# EAGLE design iomodul_shield_basic (EAGLE 6.6.0)
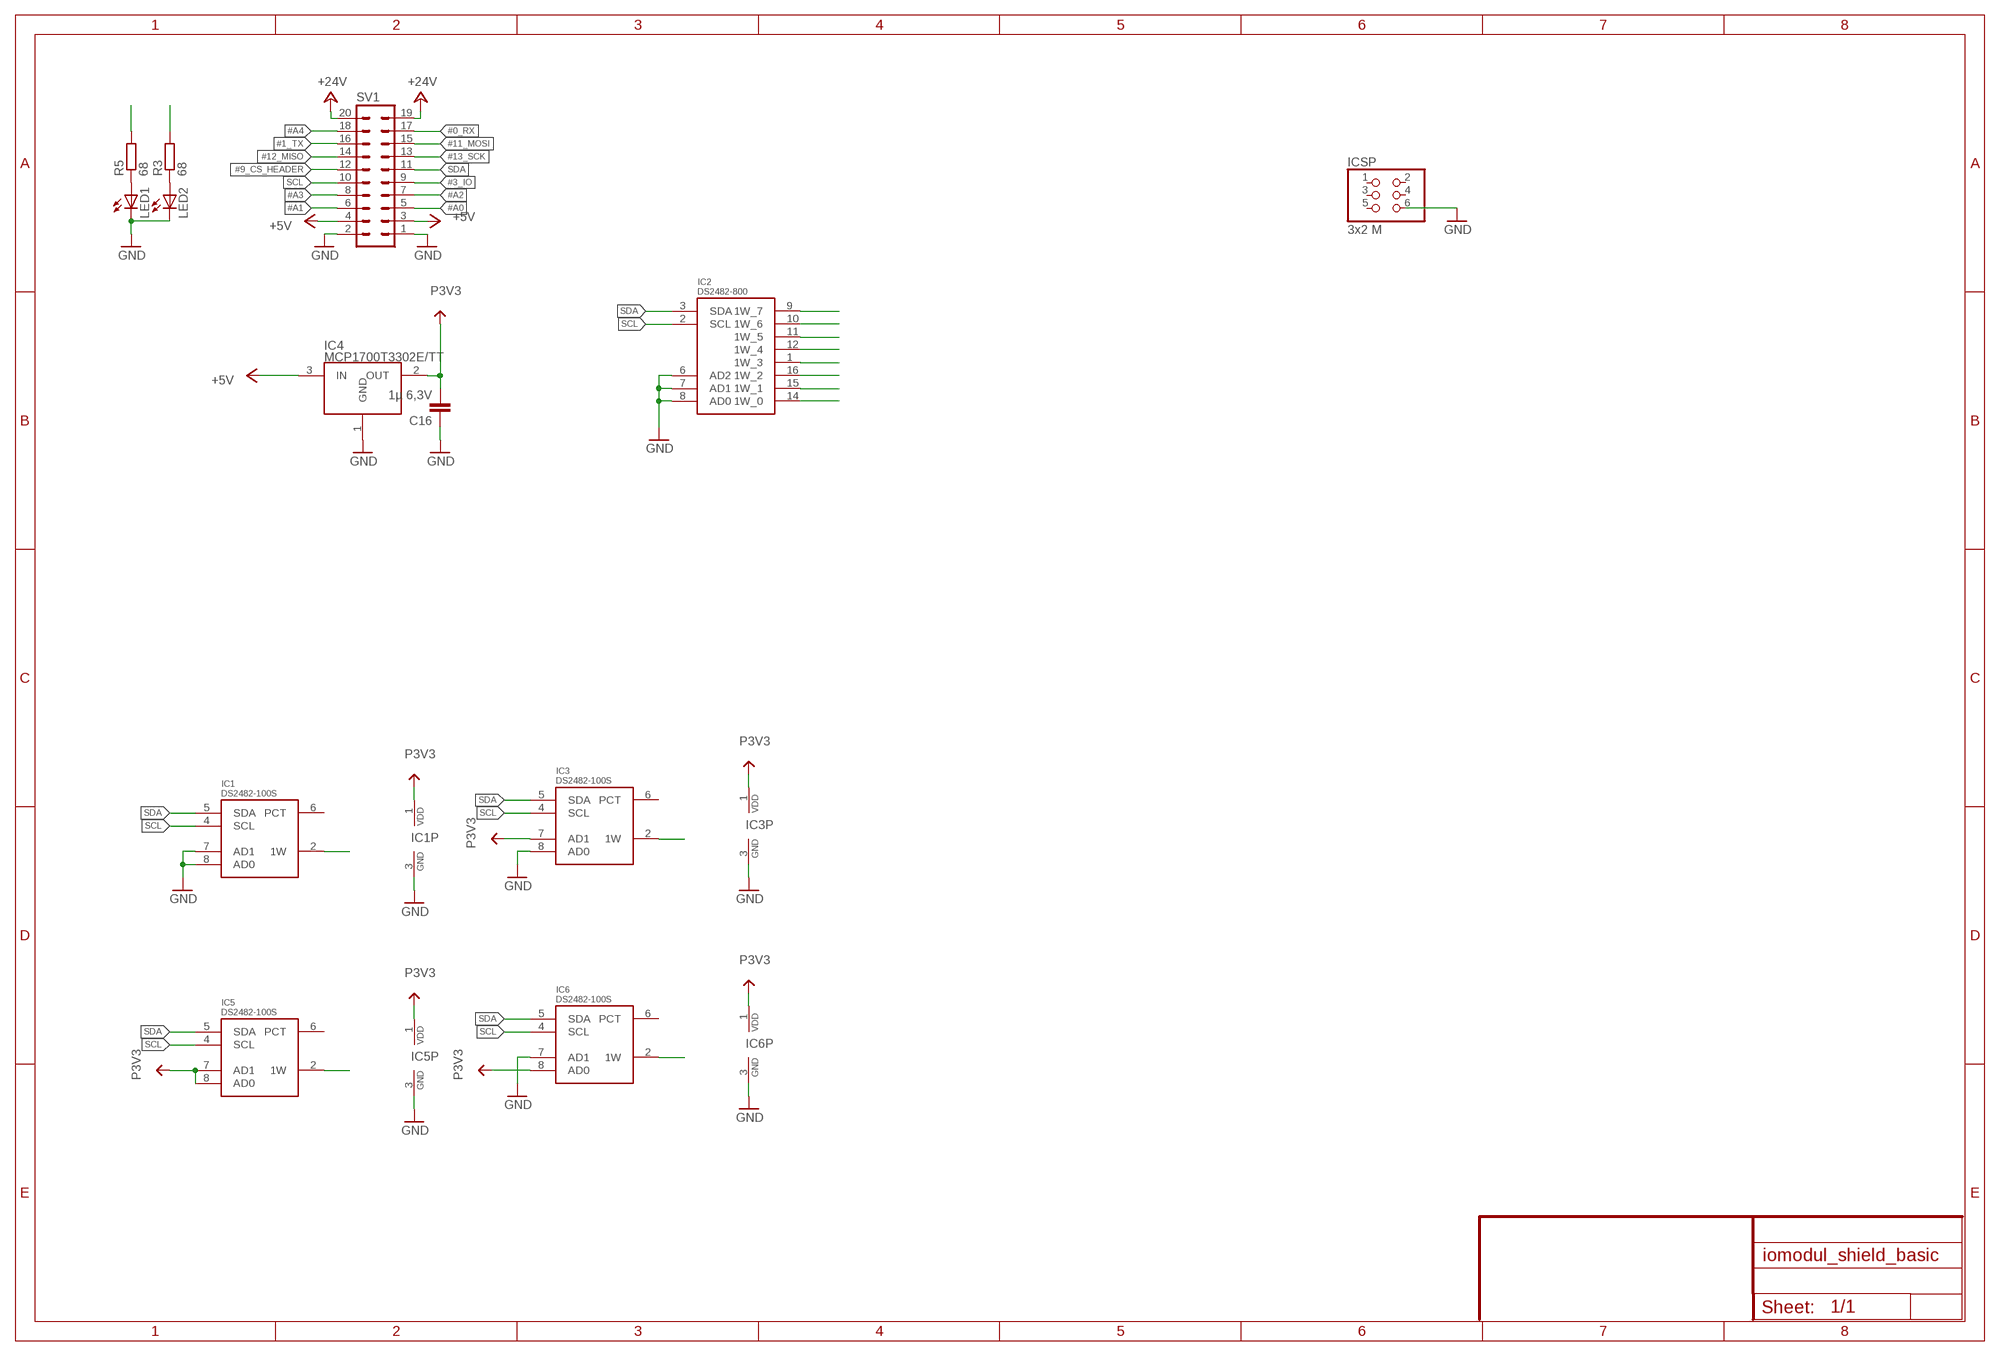
[diagram p0: schematic, sheet 1]

## Parts
C16  1µ 6,3V  C-EUC1206  [C1206]
IC1  DS2482-100S  [SO08]
IC2  DS2482-800  [SO16]
IC3  DS2482-100S  [SO08]
IC4  MCP1700T3302E/TT  MCP1700  [SOT23]
IC5  DS2482-100S  [SO08]
IC6  DS2482-100S  [SO08]
ICSP  3x2 M  0114_PH254-203DF118A00V  [2X03]
LED1  LEDCHIPLED_0805  [CHIPLED_0805]
LED2  LEDCHIPLED_0805  [CHIPLED_0805]
R3  68  R-EU_R0805  [R0805]
R5  68  R-EU_R0805  [R0805]
SV1  MA10-2  [MA10-2]

## Nets
1W1: IC2.9(1W_7) IC3.2(1W)
1W2: IC1.2(1W) IC2.10(1W_6)
1W3: IC2.11(1W_5) IC5.2(1W)
1W4: IC2.12(1W_4) IC6.2(1W)
1W5: IC2.1(1W_3)
1W6: IC2.16(1W_2)
1W7: IC2.15(1W_1)
1W8: IC2.14(1W_0)
#0_RX: SV1.17
#1_TX: SV1.16
#3_IO: SV1.9
#9_CS_HEADER: SV1.12
#11_MOSI: SV1.15
#12_MISO: SV1.14
#13_SCK: SV1.13
#A0: SV1.5
#A1: SV1.6
#A2: SV1.7
#A3: SV1.8
#A4: SV1.18
+5V: IC4.3(IN) SV1.3 SV1.4
+24V: SV1.19 SV1.20
GND: C16.1 IC1.3(GND) IC1.7(AD1) IC1.8(AD0) IC2.6(AD2) IC2.7(AD1) IC2.8(AD0) IC3.3(GND) IC3.8(AD0) IC4.1(GND) IC5.3(GND) IC6.3(GND) IC6.7(AD1) ICSP.6 LED1.C LED2.C SV1.1 SV1.2
LED2: R3.2
N$1: R5.2
N$3: LED2.A R3.1
N$7: LED1.A R5.1
P3V3: C16.2 IC1.1(VDD) IC3.1(VDD) IC3.7(AD1) IC4.2(OUT) IC5.1(VDD) IC5.7(AD1) IC5.8(AD0) IC6.1(VDD) IC6.8(AD0)
SCL: IC1.4(SCL) IC2.2(SCL) IC3.4(SCL) IC5.4(SCL) IC6.4(SCL) SV1.10
SDA: IC1.5(SDA) IC2.3(SDA) IC3.5(SDA) IC5.5(SDA) IC6.5(SDA) SV1.11
Unconnected: IC1.6(PCT) IC3.6(PCT) IC5.6(PCT) IC6.6(PCT) ICSP.1 ICSP.2 ICSP.3 ICSP.4 ICSP.5

## Power pins joined to a net without a drawn wire
GND: IC2.13(GND)
VDD: IC2.4(VDD)

## Library data of the parts
C16 = schlager_passiv:C-EU: CAPACITOR, European symbol
IC1 IC3 IC5 IC6 = 1wire:DS2482-100: I2C to 1-Wire Host Adapter/Line Driver This device is a onewire host and I2C interface in one chip. It provides the complete DC/AC requirements for onewire communication, including overdrive speed mode, but, unlike the DS2480B chip, no 12V EPROM programming. Notes: For overdrive speed and 5V EEPROM programming, an external active pullup circuit must be connected to the 1W, VDD and PCT pin. See the datasheet for details. The lower two I2C adress bits of the chip can be selected by external pins, so up to 4 chips may be connected to the same I2C bus. Author: Orginal device and description from Giovanni Varasano <giovanni.varasano@fastwebnet.it> Improved by Jan Kandziora <jjj@gmx.de>
IC2 = 1wire:DS2482-800: 8 Channel I2C to 1-Wire Host Adapter/Line Driver This device is a onewire host and I2C interface in one chip. It provides the complete DC/AC requirements for onewire communication, including overdrive speed mode, but, unlike the DS2480B chip, no 12V EPROM programming. Notes: Unlike the DS2482-100, no external cicuit is required for overdrive speed and 5V EEPROM programming. The chip is really only a single onewire host with an additional 1-to-8 line selector. You may see it as a DS2482-100 / multi-DS2409 combo. The lower three I2C adress bits of the chip can be selected by external pins, so up to 8 chips may be connected to the same I2C bus. Author: Orginal device and description from Giovanni Varasano <giovanni.varasano@fastwebnet.it> Improved by Jan Kandziora <jjj@gmx.de>
IC4 = MYMCHIP:MCP1700: LDO 250mA
ICSP = Connettori:0114_PH254-203DF118A00V: 3x2 M V h 8,5 mm p2,54; MONTHLY_USAGE: _____; PART_NUMBER: PH254-203DF118A00V; PRICE: _____; SUPPLIER: _____; TYPE: Connettori; VALUE: ICSP
LED1 LED2 = led:LED: LED OSRAM: - CHIPLED LG R971, LG N971, LY N971, LG Q971, LY Q971, LO R971, LY R971 LH N974, LH R974 LS Q976, LO Q976, LY Q976 LO Q996 - Hyper CHIPLED LW Q18S LB Q993, LB Q99A, LB R99A - SideLED LS A670, LO A670, LY A670, LG A670, LP A670 LB A673, LV A673, LT A673, LW A673 LH A674 LY A675 LS A676, LA A676, LO A676, LY A676, LW A676 LS A679, LY A679, LG A679 - Hyper Micro SIDELED® LS Y876, LA Y876, LO Y876, LY Y876 LT Y87S - SmartLED LW L88C, LW L88S LB L89C, LB L89S, LG L890 LS L89K, LO L89K, LY L89K LS L896, LA L896, LO L896, LY L896 - TOPLED LS T670, LO T670, LY T670, LG T670, LP T670 LSG T670, LSP T670, LSY T670, LOP T670, LYG T670 LG T671, LOG T671, LSG T671 LB T673, LV T673, LT T673, LW T673 LH T674 LS T676, LA T676, LO T676, LY T676, LB T676, LH T676, LSB T676, LW T676 LB T67C, LV T67C, LT T67C, LS T67K, LO T67K, LY T67K, LW E67C LS E67B, LA E67B, LO E67B, LY E67B, LB E67C, LV E67C, LT E67C LW T67C LS T679, LY T679, LG T679 LS T770, LO T770, LY T770, LG T770, LP T770 LB T773, LV T773, LT T773, LW T773 LH T774 LS E675, LA E675, LY E675, LS T675 LS T776, LA T776, LO T776, LY T776, LB T776 LHGB T686 LT T68C, LB T68C - Hyper Mini TOPLED® LB M676 - Mini TOPLED Santana® LG M470 LS M47K, LO M47K, LY M47K Source: http://www.osram.convergy.de LUXEON: - LUMILED® LXK2-PW12-R00, LXK2-PW12-S00, LXK2-PW14-U00, LXK2-PW14-V00 LXK2-PM12-R00, LXK2-PM12-S00, LXK2-PM14-U00 LXK2-PE12-Q00, LXK2-PE12-R00, LXK2-PE12-S00, LXK2-PE14-T00, LXK2-PE14-U00 LXK2-PB12-K00, LXK2-PB12-L00, LXK2-PB12-M00, LXK2-PB14-N00, LXK2-PB14-P00, LXK2-PB14-Q00 LXK2-PR12-L00, LXK2-PR12-M00, LXK2-PR14-Q00, LXK2-PR14-R00 LXK2-PD12-Q00, LXK2-PD12-R00, LXK2-PD12-S00 LXK2-PH12-R00, LXK2-PH12-S00 LXK2-PL12-P00, LXK2-PL12-Q00, LXK2-PL12-R00 Source: www.luxeon.com KINGBRIGHT: KA-3528ASYC Source: www.kingbright.com
R3 R5 = schlager_passiv:R-EU_: RESISTOR, European symbol
SV1 = con-lstb:MA10-2: PIN HEADER; OC_FARNELL: unknown; OC_NEWARK: unknown

## Net classes
0 default: width 0.203 mm, drill 0.203 mm, clearance 0.178 mm
2 gnd: width 0.254 mm, drill 0.254 mm, clearance 0.178 mm
3 usbvcc: width 0.203 mm, drill 0.406 mm, clearance 0.178 mm
4 USBpair: width 0.254 mm, drill 0.406 mm, clearance 0.508 mm

## Board
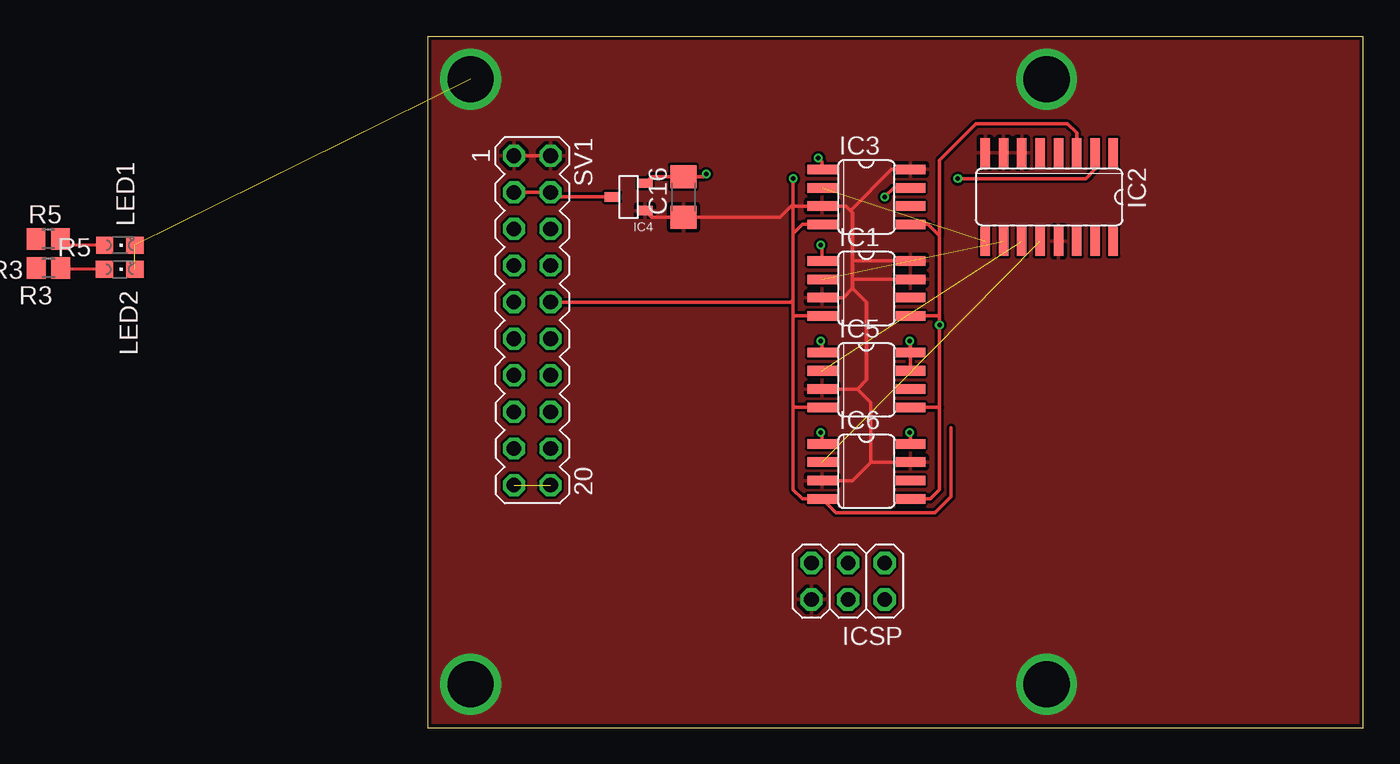
[diagram p1: board, top side]
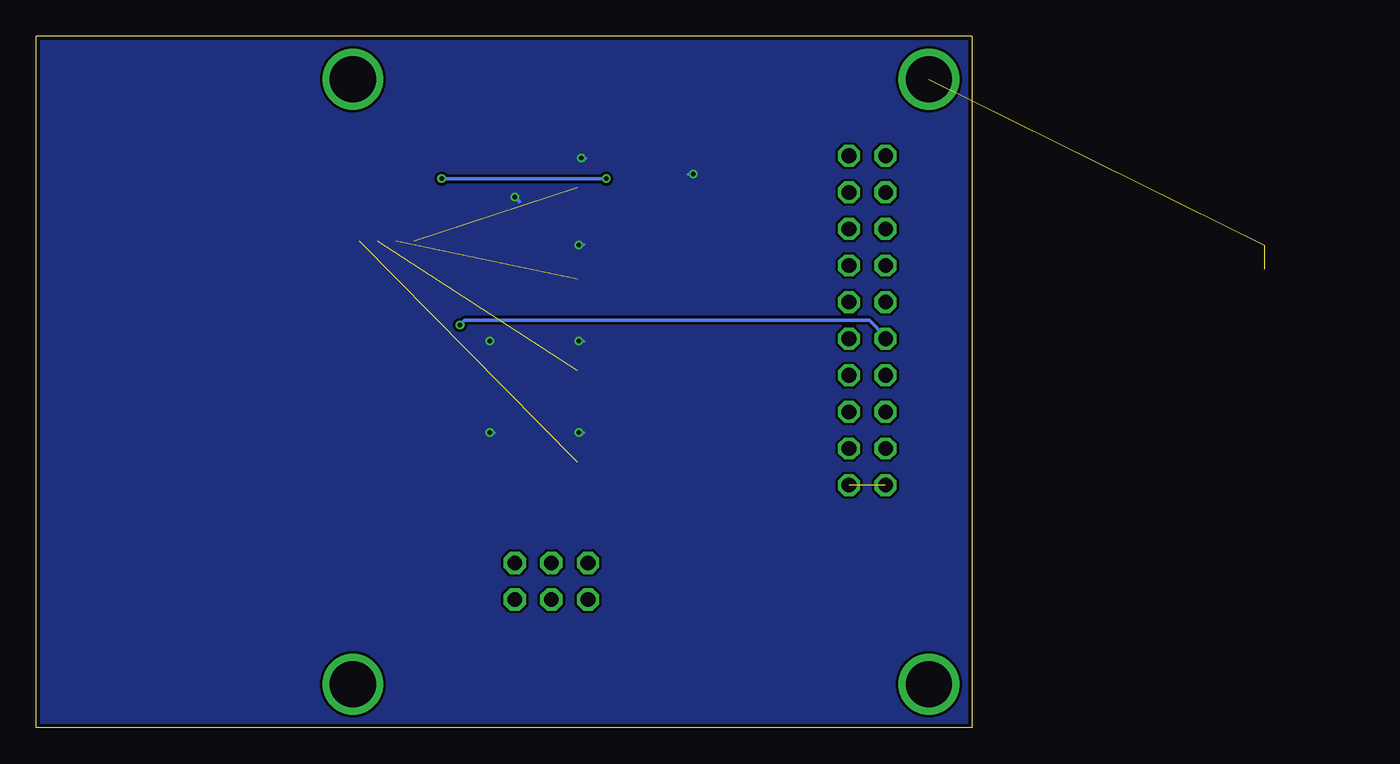
[diagram p2: board, bottom side, seen from below]

Size 65 x 48 mm. Coordinates in mm from the lower left corner, seen from the top.
Outline: 0,0 65,0 65,48 0,48 0,0
Copper layers (1*16): Top 0.035mm / dielectric 1.5mm / Bottom 0.035mm
Design rules "ITEADstudio_DRC": minimum track width 6mil, minimum drill 12mil, track to track 6mil, track to pad 6mil, pad to pad 6mil, via to via 6mil, smd to smd 0mil, copper to edge 10mil, drill to drill 10mil, minimum pad ring 10mil, minimum via ring 6mil, stop-mask expansion 2mil, vias tented up to drill 100mil, thermal gap 10mil

### Footprints (pad centres in the part's own frame; a part is rotated, then mirrored left to right if it is on the bottom)
C1206 = smd 1.6 x 1.8: 1 -1.4,0; 2 1.4,0
SO08 = smd 0.66 x 2.032: 1 -1.905,-3.073; 2 -0.635,-3.073; 3 0.635,-3.073; 4 1.905,-3.073; 5 1.905,3.073; 6 0.635,3.073; 7 -0.635,3.073; 8 -1.905,3.073
SO16 = smd 0.66 x 2.032: 1 -4.445,-3.073; 2 -3.175,-3.073; 3 -1.905,-3.073; 4 -0.635,-3.073; 5 0.635,-3.073; 6 1.905,-3.073; 7 3.175,-3.073; 8 4.445,-3.073; 9 4.445,3.073; 10 3.175,3.073; 11 1.905,3.073; 12 0.635,3.073; 13 -0.635,3.073; 14 -1.905,3.073; 15 -3.175,3.073; 16 -4.445,3.073
SOT23 = smd 0.65 x 1.05: 1 -0.95,-1.15; 2 0.95,-1.15; 3 0,1.15
2X03 = drill 1.016 pad 1.55 octagon: 1 -2.54,-1.27; 2 -2.54,1.27; 3 0,-1.27; 4 0,1.27; 5 2.54,-1.27; 6 2.54,1.27
CHIPLED_0805 = smd 1.2 x 1.2: A 0,-1.05; C 0,1.05
R0805 = smd 1.3 x 1.5: 1 -0.85,0; 2 0.85,0
MA10-2 = drill 1.016 octagon: 1 -11.43,-1.27; 2 -11.43,1.27; 3 -8.89,-1.27; 4 -8.89,1.27; 5 -6.35,-1.27; 6 -6.35,1.27; 7 -3.81,-1.27; 8 -3.81,1.27; 9 -1.27,-1.27; 10 -1.27,1.27; 11 1.27,-1.27; 12 1.27,1.27; 13 3.81,-1.27; 14 3.81,1.27; 15 6.35,-1.27; 16 6.35,1.27; 17 8.89,-1.27; 18 8.89,1.27; 19 11.43,-1.27; 20 11.43,1.27

### Placement (x,y rotation side)
C16  17.78,36.83 90 top
IC1  30.48,30.48 270 top
IC2  43.18,36.83 180 top
IC3  30.48,36.83 270 top
IC4  13.97,36.83 90 top
IC5  30.48,24.13 270 top
IC6  30.48,17.78 270 top
ICSP  29.21,10.16 180 top
LED1  -21.36,33.48 270 top  (outside the outline)
LED2  -21.36,31.81 270 top  (outside the outline)
R3  -26.31,31.9 180 top  (outside the outline)
R5  -26.33,33.91 180 top  (outside the outline)
SV1  7.28,28.26 270 top

### Tracks (layer width: path | path; a pad name or v marks a point on that pad's centre or on a via)
1W1  (1 unrouted)
1W2  (1 unrouted)
1W3  (1 unrouted)
1W4  (1 unrouted)
+5V
  Top 0.254: IC4.3 8.87,36.83 SV1.4 SV1.3
+24V  (1 unrouted)
GND  (via drill 3.2)  (2 unrouted)
  Top 0.254: IC4.1 15.57,35.43 C16.1 24.48,35.43 25.24,36.2 IC3.3 29.05,36.2 29.37,35.88 | SV1.1 SV1.2 | 29.37,35.88 29.53,35.72 29.53,32.38 | 29.53,32.38 29.53,31.11 | 29.53,31.11 29.53,30.48 | 29.53,30.48 28.89,29.84 IC1.3 | IC1.7 29.53,31.11 | IC1.8 29.53,32.38 | IC3.8 32.23,38.73 29.37,35.88 | IC6.3 29.53,17.14 30.8,18.41 | 30.8,18.41 IC6.7 | 30.8,18.41 30.8,22.54 29.84,23.5 | IC5.3 29.84,23.5 | 29.84,23.5 30.48,24.13 30.48,29.53 29.53,30.48
  other vias: 3,3 3,45 43,3 43,45
  pour Top: -1.27,50.8 68.58,50.8 68.58,-3.81 -1.27,-3.81
N$3
  Top 0.203: LED2.A -25.37,31.81 R3.1
N$7
  Top 0.203: LED1.A -25.05,33.48 R5.1
P3V3  (via drill 0.3)
  Top 0.254: IC4.2 15.57,38.23 C16.2 19.18,38.23 v19.37,38.42 | IC3.7 32.38,37.47 v31.75,36.83 | IC1.1 27.41,33.4 v27.3,33.5 | IC5.1 27.41,26.73 v27.3,26.83 | IC6.1 27.41,20.38 v27.3,20.48 | IC3.1 27.41,39.27 v27.15,39.53 | IC6.8 33.55,20.42 v33.5,20.48 | IC5.7 IC5.8 33.55,26.77 v33.5,26.83
  Bottom 0.254: v31.75,36.83 31.43,36.51 | v27.3,33.5 26.99,33.5 | v27.3,26.83 26.99,26.83 | v27.3,20.48 26.99,20.48 | v27.15,39.53 26.83,39.53 | v19.37,38.42 19.68,38.42 | v33.5,20.48 33.18,20.48 | v33.5,26.83 33.34,26.83
  pour Bottom: -3.81,52.07 71.12,52.07 71.12,-6.35 -3.81,-6.35
SCL  (via drill 0.3)
  Top 0.254: IC3.4 26.04,34.92 25.4,34.29 | 25.4,34.29 25.4,29.69 | 25.4,29.69 25.4,28.57 | 25.4,28.57 25.4,22.38 | 25.4,22.38 25.4,16.51 26.04,15.88 IC6.4 28.36,14.92 35.24,14.92 36.35,16.03 36.35,20.8 | IC5.4 25.56,22.23 25.4,22.38 | IC1.4 25.4,28.57 | SV1.10 25.24,29.53 25.4,29.69 | IC2.2 46.35,38.73 45.72,38.1 v36.83,38.1 | v25.4,38.1 25.4,34.29
  Bottom 0.254: v36.83,38.1 v25.4,38.1
SDA  (via drill 0.3)
  Top 0.254: IC6.5 34.92,15.88 35.56,16.51 35.56,22.23 | 35.56,22.23 v35.56,27.94 35.56,28.57 | 35.56,28.57 35.56,34.13 35.48,34.21 | 35.48,34.21 34.77,34.92 IC3.5 | IC5.5 35.56,22.23 | IC1.5 35.56,28.57 | IC2.3 45.09,41.27 44.45,41.91 38.1,41.91 35.56,39.37 35.56,34.29 35.48,34.21
  Bottom 0.254: SV1.11 6.01,27.12 7.14,28.26 35.24,28.26 v35.56,27.94

### Text on the board
_tNames: R5 | R3